# Altium schematic sheet output-connectors.SchDoc: Analog Output Connectors
size A3; DocumentNumber: 9; SheetNumber: 9; SheetTotal: 9
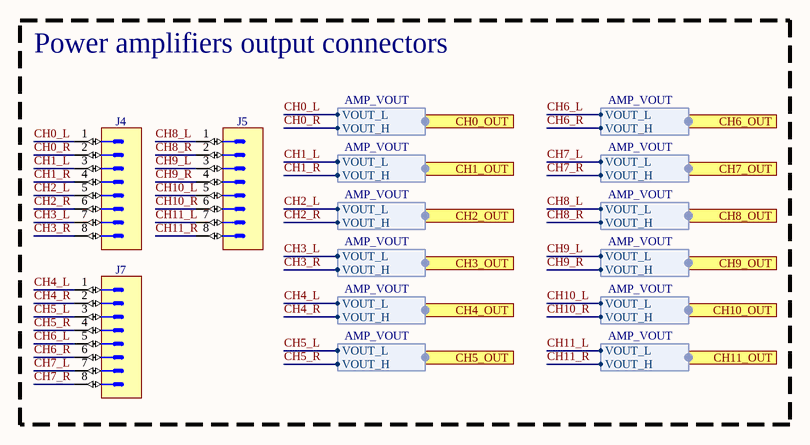
[diagram p0: output-connectors.SchDoc]

## Parts
J4  Euroblock  [MOLEX_39502-1008]  (value not drawn)
J5  Euroblock  [MOLEX_39502-1008]  (value not drawn)
J7  Euroblock  [MOLEX_39502-1008]  (value not drawn)

## Blocks framed on the sheet
Power amplifiers output connectors: J4 J5 J7

## Ports
CH0_OUT (harness AMP_VOUT), CH1_OUT (harness AMP_VOUT), CH2_OUT (harness AMP_VOUT), CH3_OUT (harness AMP_VOUT), CH4_OUT (harness AMP_VOUT), CH5_OUT (harness AMP_VOUT), CH6_OUT (harness AMP_VOUT), CH7_OUT (harness AMP_VOUT), CH8_OUT (harness AMP_VOUT), CH9_OUT (harness AMP_VOUT), CH10_OUT (harness AMP_VOUT), CH11_OUT (harness AMP_VOUT)

## Harnesses
AMP_VOUT: VOUT_L, VOUT_H

## Nets
CH0_L: J4.1 ; port CH0_OUT.VOUT_L
CH0_R: J4.2 ; port CH0_OUT.VOUT_H
CH1_L: J4.3 ; port CH1_OUT.VOUT_L
CH1_R: J4.4 ; port CH1_OUT.VOUT_H
CH2_L: J4.5 ; port CH2_OUT.VOUT_L
CH2_R: J4.6 ; port CH2_OUT.VOUT_H
CH3_L: J4.7 ; port CH3_OUT.VOUT_L
CH3_R: J4.8 ; port CH3_OUT.VOUT_H
CH4_L: J7.1 ; port CH4_OUT.VOUT_L
CH4_R: J7.2 ; port CH4_OUT.VOUT_H
CH5_L: J7.3 ; port CH5_OUT.VOUT_L
CH5_R: J7.4 ; port CH5_OUT.VOUT_H
CH6_L: J7.5 ; port CH6_OUT.VOUT_L
CH6_R: J7.6 ; port CH6_OUT.VOUT_H
CH7_L: J7.7 ; port CH7_OUT.VOUT_L
CH7_R: J7.8 ; port CH7_OUT.VOUT_H
CH8_L: J5.1 ; port CH8_OUT.VOUT_L
CH8_R: J5.2 ; port CH8_OUT.VOUT_H
CH9_L: J5.3 ; port CH9_OUT.VOUT_L
CH9_R: J5.4 ; port CH9_OUT.VOUT_H
CH10_L: J5.5 ; port CH10_OUT.VOUT_L
CH10_R: J5.6 ; port CH10_OUT.VOUT_H
CH11_L: J5.7 ; port CH11_OUT.VOUT_L
CH11_R: J5.8 ; port CH11_OUT.VOUT_H

## Notes on the sheet
- Title:
- Date:
- Project:
- Drawn by:
- Time:
- Revision:
- Sheet
- of
- Grupo de Controles Avaçandos -
  GCA - LNLS
- Copyright CNPEM 2020.
  This documentation describes Open Hardware and is licensed under the CERN OHL S v2. You may redistribute and modify this documentation under the terms of the CERN OHL S v2. (https://www.ohwr.org/cernohl). This documentation is distributed WITHOUT ANY EXPRESS OR IMPLIED WARRANTY, INCLUDING OF MERCHANTABILITY, SATISFACTORY QUALITY AND FITNESS FOR A PARTICULAR PURPOSE. Please see the CERN OHL S v2 for applicable conditions.
- File:

## Library data of the parts
J4 J5 J7 = MOLEX_39502-1008: 3.50mm Pitch Eurostyle Horizontal PCB Header, 8 Circuits; Manufacturer: MOLEX; Manufacturer Part Number: 395021008; PressFit: No; Part Number: MOLEX_39502-1008; Component Kind: Standard; Component Type: Standard; Pin Count: 8; Family: Euroblock; Mounted: Yes; Socket: No; SMD: No; Sense: No; Status: None; ComponentHeight: 6.9mm; Author: LNLS DIG AFG; CreateDate: 09/07/2020; LatestRevisionDate: 09/07/2020